# EAGLE design power_sense (EAGLE 5.12)
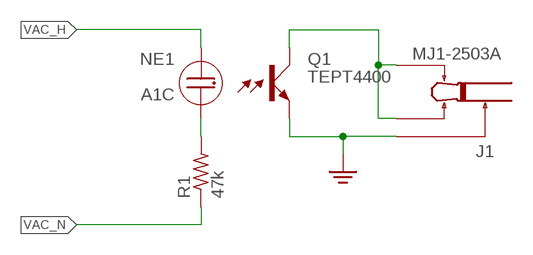
[diagram p0: schematic, sheet 1]

## Parts
J1  MJ1-2503A  [MJ1-2503A]
NE1  A1C  [A1C]
Q1  TEPT4400  [OPTO3MM]
R1  47k  R-1206  [1206]

## Nets
GND: J1.1(GND) Q1.E
N$1: J1.2(MONO) J1.3(MONO) Q1.C
N$4: NE1.P$1 R1.2
VAC_H: NE1.P$2
VAC_N: R1.1

## Library data of the parts
J1 = aim-connectors:MJ1-2503A
NE1 = aim-lamp:A1C: Neon Lamp www.vcclite.com
Q1 = aim-transistor:TEPT4400: Ambient Light Sensor Opto-Transistor NPN
R1 = aim-passives:R

## Board
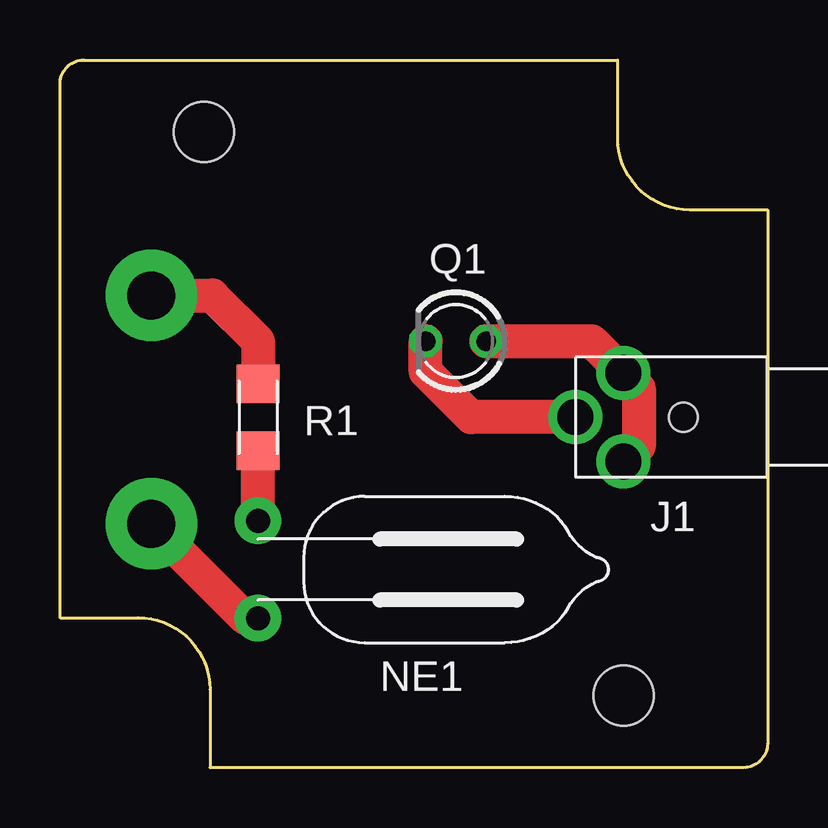
[diagram p1: board, top side]

Size 29.5 x 29.5 mm. Coordinates in mm from the lower left corner, seen from the top.
Copper layers (1*16): Top 0.035mm / dielectric 1.5mm / Bottom 0.035mm
Design rules "default": minimum track width 10mil, minimum drill 0.6mm, track to track 8mil, track to pad 8mil, pad to pad 8mil, via to via 8mil, smd to smd 8mil, copper to edge 40mil, drill to drill 8mil, minimum pad ring 10mil, minimum via ring 8mil, stop-mask expansion 4mil, vias tented up to drill 0mil, thermal gap 10mil

### Footprints (pad centres in the part's own frame; a part is rotated, then mirrored left to right if it is on the bottom)
MJ1-2503A = drill 1.5 round: 1 2,0; 2 0,-1.85; 3 0,1.85 | hole 1.2: -2.5,0
A1C = drill 1 pad 1.93 round: P$1 -2.032,-1.905; P$2 2.032,-1.905
OPTO3MM = drill 0.813 octagon: C -1.27,0; E 1.27,0
1206 = smd 1.6 x 1.8: 1 -1.4,0; 2 1.4,0
1551NFL = hole 2.5: 6,26.5; 23.5,3

### Placement (x,y rotation side)
J1  23.5,14.61 180 top
NE1  10.16,8.26 270 top
Q1  16.51,17.78 180 top
R1  8.26,14.61 270 top
U$1  [1551NFL]  0,0 0 top

### Tracks (layer width: path | path; a pad name or v marks a point on that pad's centre or on a via)
GND
  Top 1.422: J1.1 17.14,14.61 15.24,16.51 Q1.E
N$1
  Top 1.27: J1.2 24.13,15.82
  Top 1.422: J1.2 22.17,17.78 Q1.C | J1.3 24.13,13.39 24.13,15.82
N$4
  Top 1.422: NE1.P$1 R1.2
VAC_H  (via drill 2 pad 3.81)
  Top 1.422: v3.81,10.16 7.75,6.22 NE1.P$2
VAC_N  (via drill 2 pad 3.81)
  Top 1.422: v3.81,19.68 6.35,19.68 8.26,17.78 R1.1

### Text on the board
Unrouted: VIAS HAVE SOLDER MASK
_tPlace: Alex Mykyta | 2015-12
_tNames: Q1 | R1 | J1 | NE1